# Altium schematic sheet Microcontroller_STC12C5A60S2.SchDoc: Microcontroller_STC12C5A60S2
size A4
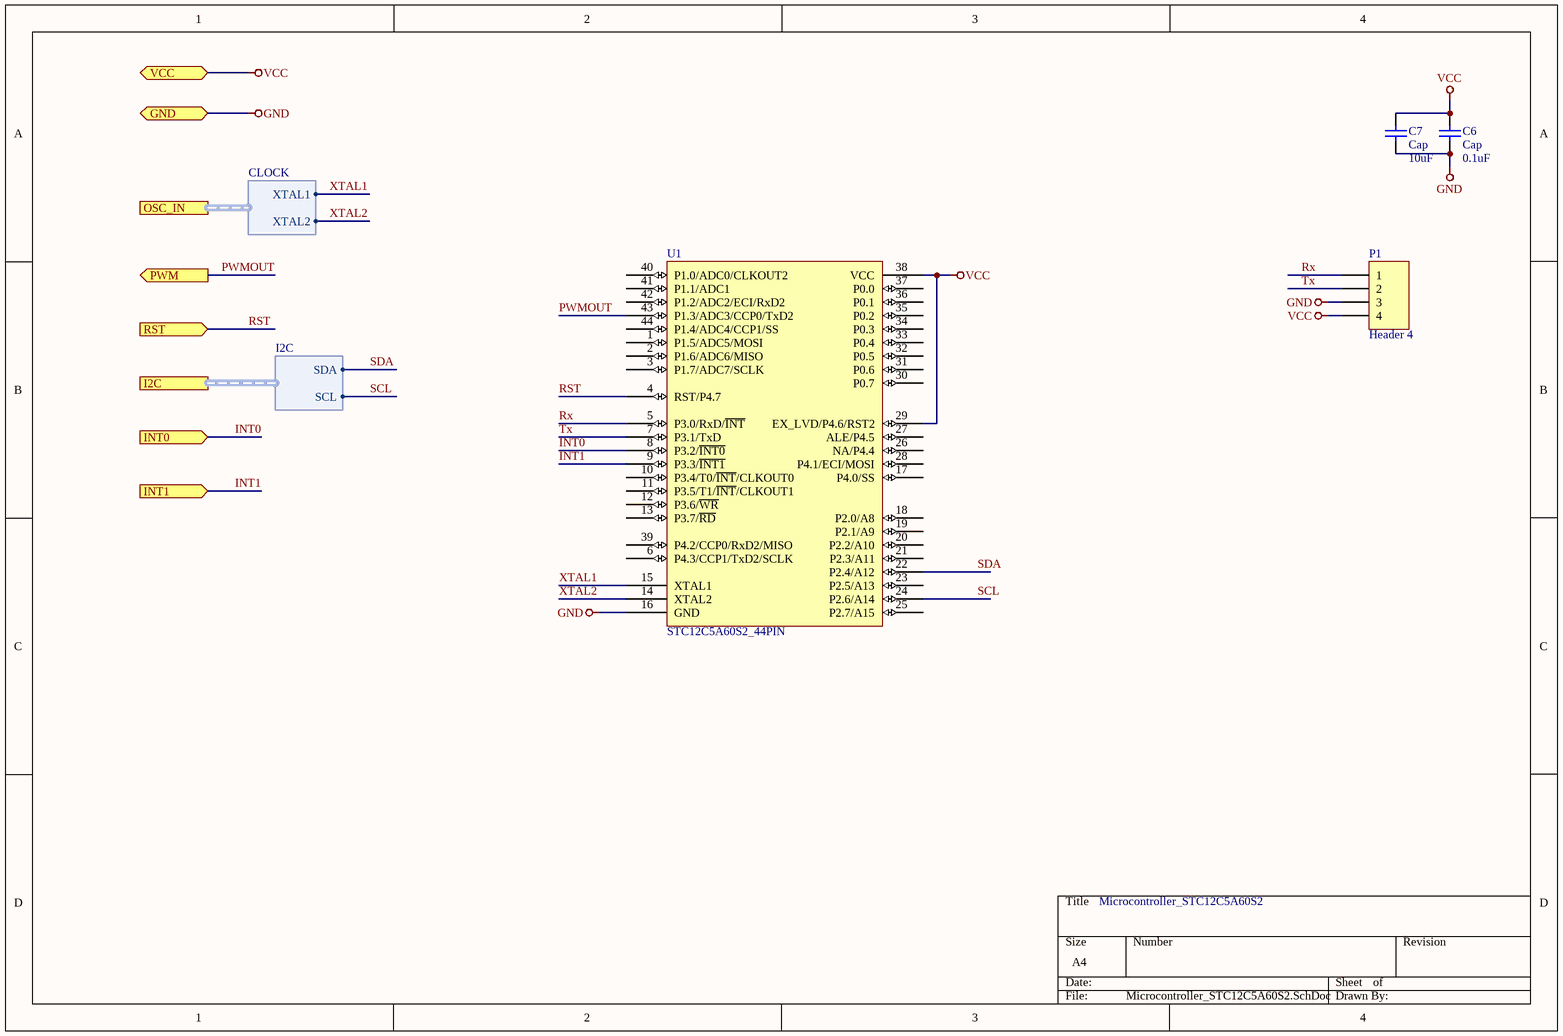
[diagram p0: Microcontroller_STC12C5A60S2.SchDoc]

## Parts
C6  Cap  value 0.1uF  [C0805]
C7  Cap  value 10uF  [1206C]
P1  Header 4  [HDR1X4HA]
U1  STC12C5A60S2_44PIN  [STC12C5A60S2_44PIN]

## Ports
GND, I2C (harness I2C), INT0 (in), INT1 (in), OSC_IN (harness CLOCK), PWM (out), RST (in), VCC

## Harnesses
CLOCK: XTAL1, XTAL2
I2C: SDA, SCL

## Nets
GND: C6.1 C7.1 P1.3 U1.16(GND) ; port GND
VCC: C6.2 C7.2 P1.4 U1.29(EX_LVD/P4.6/RST2) U1.38(VCC) ; port VCC
INT0: U1.8(P3.2/~{INT0}) ; port INT0
INT1: U1.9(P3.3/~{INT1}) ; port INT1
PWMOUT: U1.43(P1.3/ADC3/CCP0/TxD2) ; port PWM
RST: U1.4(RST/P4.7) ; port RST
Rx: P1.1 U1.5(P3.0/RxD/~{INT})
SCL: U1.24(P2.6/A14) ; port I2C.SCL
SDA: U1.22(P2.4/A12) ; port I2C.SDA
Tx: P1.2 U1.7(P3.1/TxD)
XTAL1: U1.15(XTAL1) ; port OSC_IN.XTAL1
XTAL2: U1.14(XTAL2) ; port OSC_IN.XTAL2

Not connected (* = marked no-connect by the designer): U1 1(P1.5/ADC5/MOSI) 2(P1.6/ADC6/MISO) 3(P1.7/ADC7/SCLK) 6(P4.3/CCP1/TxD2/SCLK) 10(P3.4/T0/~{INT}/CLKOUT0) 11(P3.5/T1/~{INT}/CLKOUT1) 12(P3.6/~{WR}) 13(P3.7/~{RD}) 17(P4.0/SS) 18(P2.0/A8) 19(P2.1/A9) 20(P2.2/A10) 21(P2.3/A11) 23(P2.5/A13) 25(P2.7/A15) 26(NA/P4.4) 27(ALE/P4.5) 28(P4.1/ECI/MOSI) 30(P0.7) 31(P0.6) 32(P0.5) 33(P0.4) 34(P0.3) 35(P0.2) 36(P0.1) 37(P0.0) 39(P4.2/CCP0/RxD2/MISO) 40(P1.0/ADC0/CLKOUT2) 41(P1.1/ADC1) 42(P1.2/ADC2/ECI/RxD2) 44(P1.4/ADC4/CCP1/SS)

## Library data of the parts
C6 C7 = Cap: Non-Polar Capacitor
P1 = Header 4: Header, 4-Pin; LatestRevisionDate: 17-Jul-2002; LatestRevisionNote: Re-released for DXP Platform.; Publisher: Altium Limited
U1 = STC12C5A60S2_44PIN: MCU